# Altium schematic sheet LVDS_eDP.SchDoc
size 420 x 297 mm; SheetNumber: 22; SheetTotal: 32; DocumentTypeShort: Э3; DocumentInvertoryNumber: ㅤ
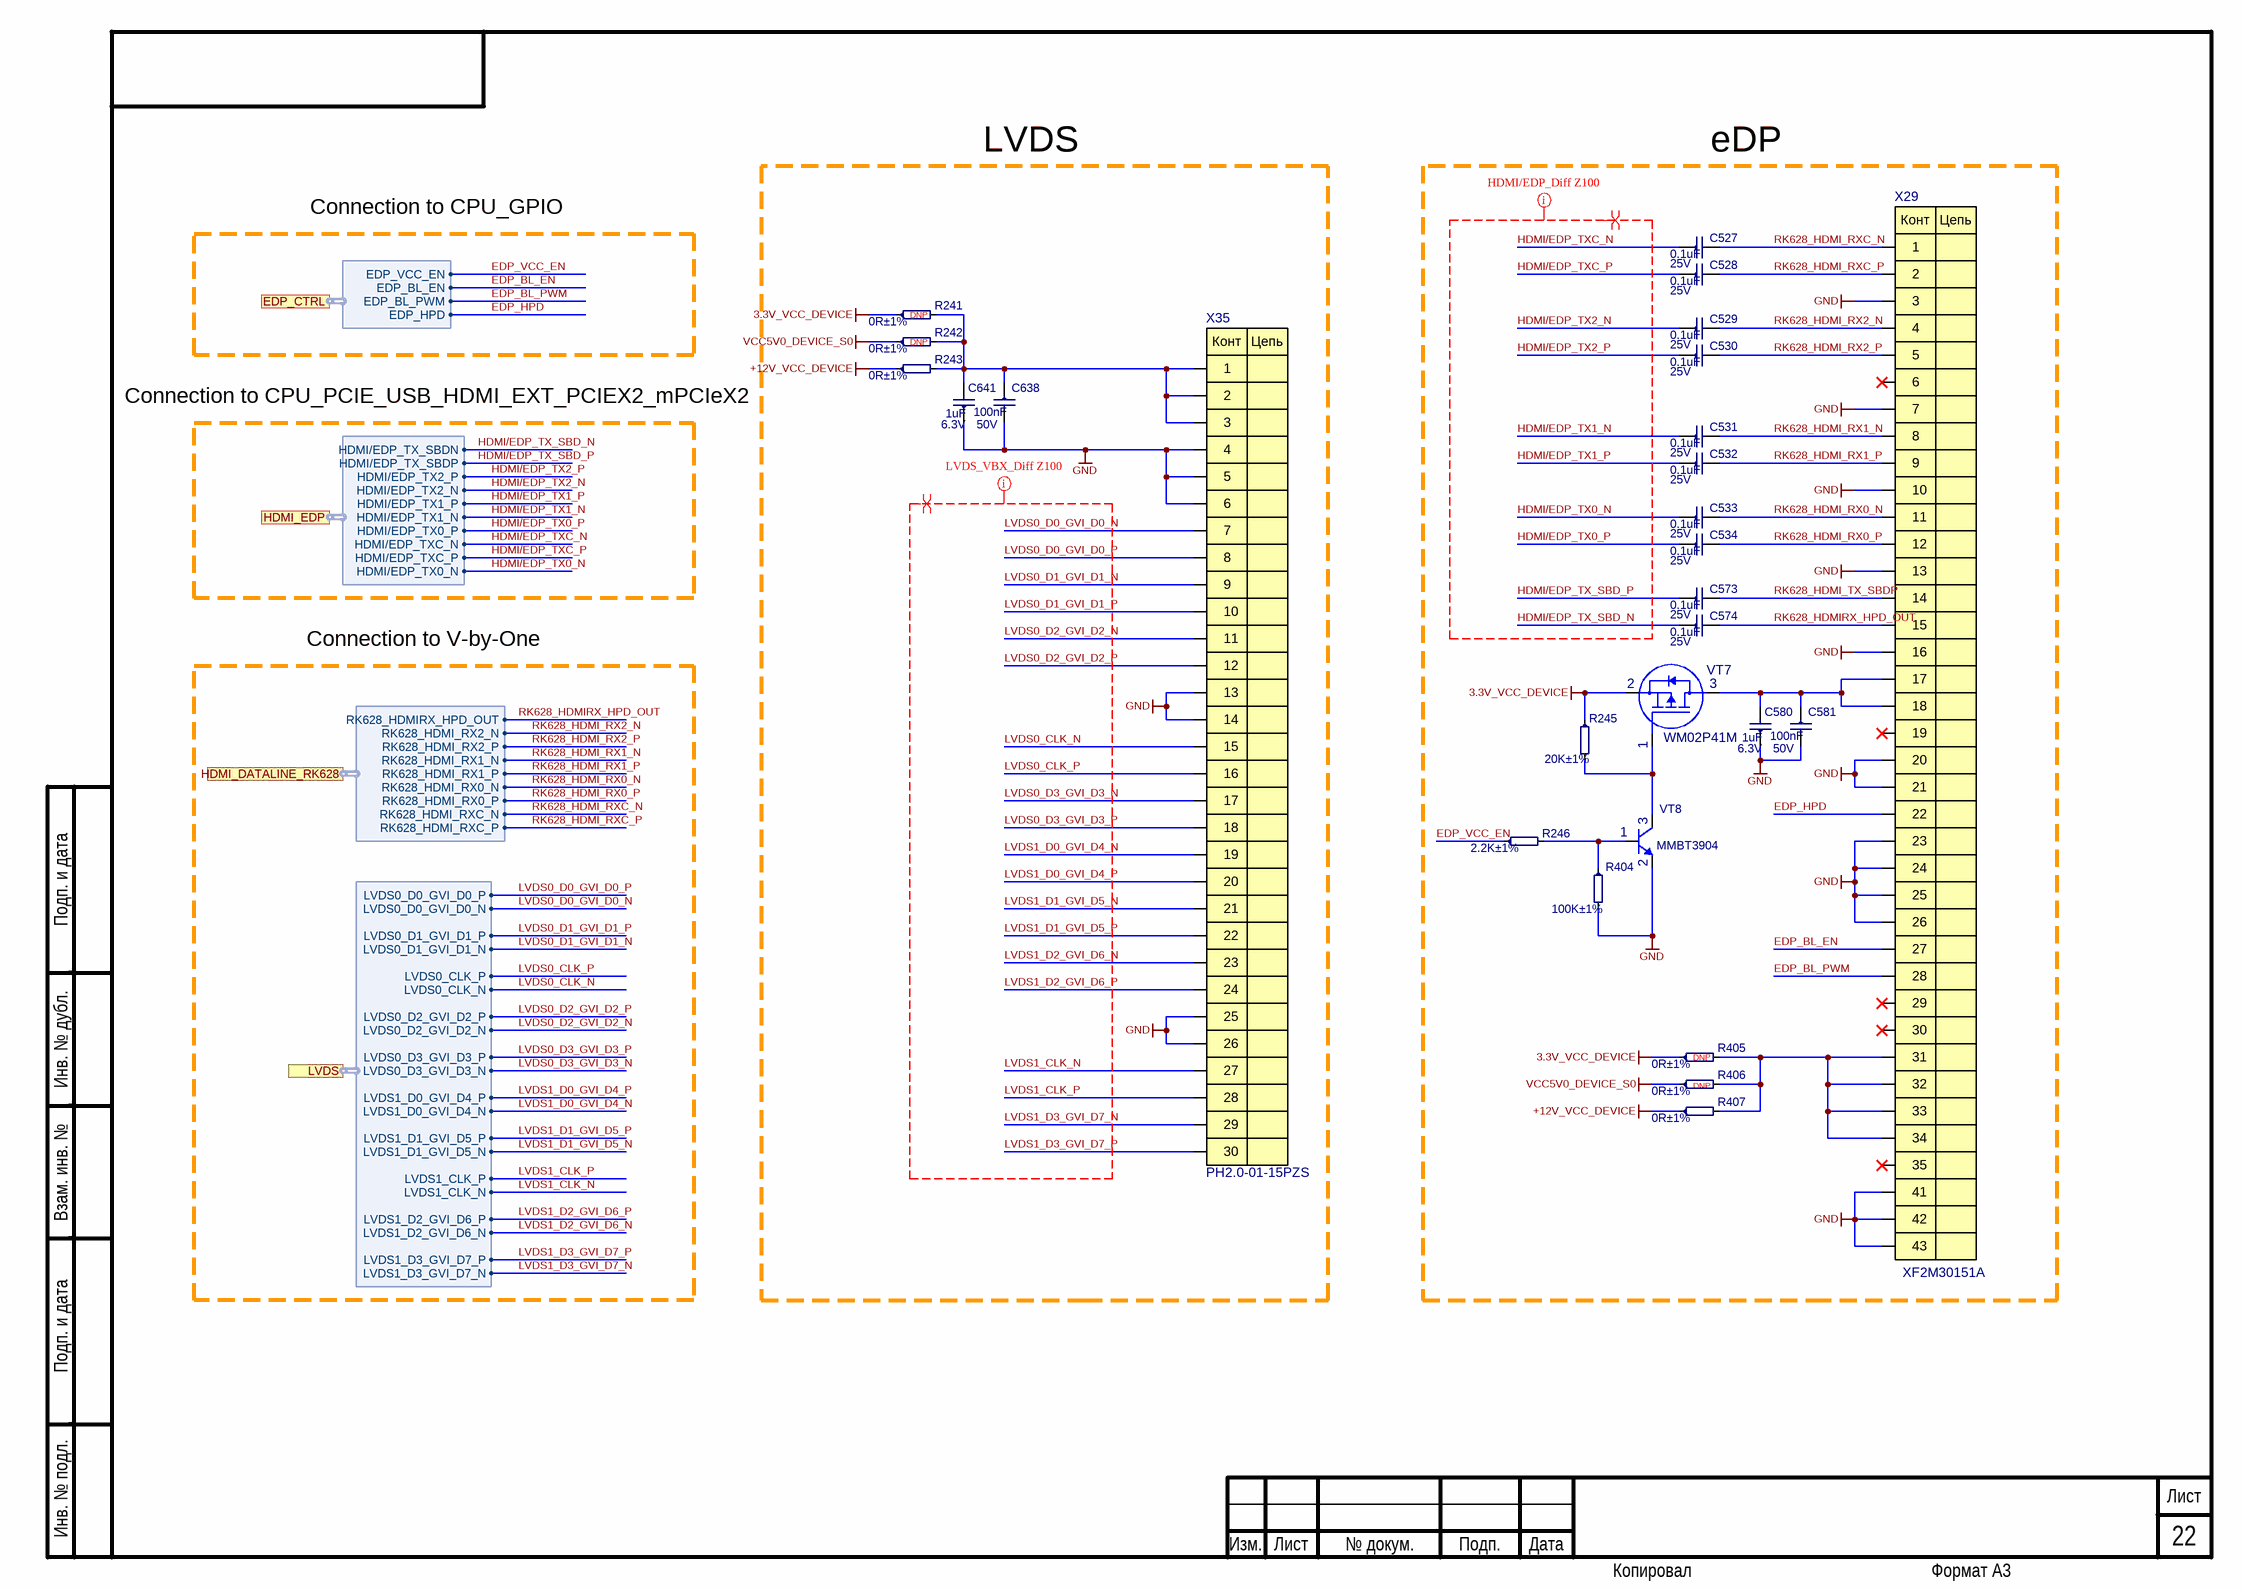
[diagram p0: LVDS_eDP.SchDoc]

## Parts
C527  0.1uF  Voltage: 25V  [C0201]
C528  0.1uF  Voltage: 25V  [C0201]
C529  0.1uF  Voltage: 25V  [C0201]
C530  0.1uF  Voltage: 25V  [C0201]
C531  0.1uF  Voltage: 25V  [C0201]
C532  0.1uF  Voltage: 25V  [C0201]
C533  0.1uF  Voltage: 25V  [C0201]
C534  0.1uF  Voltage: 25V  [C0201]
C573  0.1uF  Voltage: 25V  [C0201]
C574  0.1uF  Voltage: 25V  [C0201]
C580  1uF  Voltage: 6.3V  [C0201]
C581  100nF  Voltage: 50V  [C0402]
C638  100nF  Voltage: 50V  [C0402]
C641  1uF  Voltage: 6.3V  [C0201]
R241  0R±1%  [R0402]
R242  0R±1%  [R0402]
R243  0R±1%  [R0402]
R245  20K±1%  [R0402]
R246  2.2K±1%  [R0402]
R404  100K±1%  [R0402]
R405  0R±1%  [R0402]
R406  0R±1%  [R0402]
R407  0R±1%  [R0402]
VT7  WM02P41M  [SOT23]
VT8  MMBT3904  [SOT23]
X29  XF2M30151A  [XF2M30151A]
X35  PH2.0-01-15PZS  [PH2.0-01-15PZS]

## Ports
EDP_CTRL (harness EDP_CTRL), HDMI_DATALINE_RK628 (harness HDMI_DATALINE_RK628), HDMI_EDP (harness HDMI_EDP), LVDS (harness LVDS)

## Harnesses
LVDS: LVDS0_D0_GVI_D0_N, LVDS0_D1_GVI_D1_P, LVDS0_D1_GVI_D1_N, LVDS0_D0_GVI_D0_P, LVDS0_CLK_P, LVDS0_CLK_N, LVDS0_D2_GVI_D2_P, LVDS0_D2_GVI_D2_N, LVDS0_D3_GVI_D3_P, LVDS0_D3_GVI_D3_N, LVDS1_D0_GVI_D4_P, LVDS1_D0_GVI_D4_N, LVDS1_D1_GVI_D5_P, LVDS1_D1_GVI_D5_N, LVDS1_CLK_P, LVDS1_CLK_N, LVDS1_D2_GVI_D6_P, LVDS1_D2_GVI_D6_N, LVDS1_D3_GVI_D7_P, LVDS1_D3_GVI_D7_N
HDMI_EDP: HDMI/EDP_TX2_N, HDMI/EDP_TX1_P, HDMI/EDP_TX1_N, HDMI/EDP_TX2_P, HDMI/EDP_TX0_P, HDMI/EDP_TXC_N, HDMI/EDP_TXC_P, HDMI/EDP_TX0_N, HDMI/EDP_TX_SBDN, HDMI/EDP_TX_SBDP
HDMI_DATALINE_RK628: RK628_HDMI_RX2_P, RK628_HDMI_RX1_N, RK628_HDMI_RX1_P, RK628_HDMI_RX2_N, RK628_HDMI_RX0_N, RK628_HDMI_RX0_P, RK628_HDMI_RXC_N, RK628_HDMI_RXC_P, RK628_HDMIRX_HPD_OUT
EDP_CTRL: EDP_BL_EN, EDP_BL_PWM, EDP_VCC_EN, EDP_HPD

## Nets
3.3V_VCC_DEVICE: R241.1 R245.1 R405.1 VT7.2
+12V_VCC_DEVICE: R243.1 R407.1
GND: C580.1 C581.2 C638.2 C641.1 R404.2 VT8.2(E) X29.3 X29.7 X29.10 X29.13 X29.16 X29.20 X29.21 X29.23 X29.24 X29.25 X29.26 X29.41 X29.42 X29.43 X35.4 X35.5 X35.6 X35.13 X35.14 X35.25 X35.26
VCC5V0_DEVICE_S0: R242.1 R406.1
EDP_BL_EN: X29.27 ; port EDP_CTRL.EDP_BL_EN
EDP_BL_PWM: X29.28 ; port EDP_CTRL.EDP_BL_PWM
EDP_HPD: X29.22 ; port EDP_CTRL.EDP_HPD
EDP_VCC_EN: R246.1 ; port EDP_CTRL.EDP_VCC_EN
HDMI/EDP_TX0_N: C533.1 ; port HDMI_EDP.HDMI/EDP_TX0_N
HDMI/EDP_TX0_P: C534.1 ; port HDMI_EDP.HDMI/EDP_TX0_P
HDMI/EDP_TX1_N: C531.1 ; port HDMI_EDP.HDMI/EDP_TX1_N
HDMI/EDP_TX1_P: C532.1 ; port HDMI_EDP.HDMI/EDP_TX1_P
HDMI/EDP_TX2_N: C529.1 ; port HDMI_EDP.HDMI/EDP_TX2_N
HDMI/EDP_TX2_P: C530.1 ; port HDMI_EDP.HDMI/EDP_TX2_P
HDMI/EDP_TX_SBD_N: C574.1 ; port HDMI_EDP.HDMI/EDP_TX_SBDN
HDMI/EDP_TX_SBD_P: C573.1 ; port HDMI_EDP.HDMI/EDP_TX_SBDP
HDMI/EDP_TXC_N: C527.1 ; port HDMI_EDP.HDMI/EDP_TXC_N
HDMI/EDP_TXC_P: C528.1 ; port HDMI_EDP.HDMI/EDP_TXC_P
LVDS0_CLK_N: X35.15 ; port LVDS.LVDS0_CLK_N
LVDS0_CLK_P: X35.16 ; port LVDS.LVDS0_CLK_P
LVDS0_D0_GVI_D0_N: X35.7 ; port LVDS.LVDS0_D0_GVI_D0_N
LVDS0_D0_GVI_D0_P: X35.8 ; port LVDS.LVDS0_D0_GVI_D0_P
LVDS0_D1_GVI_D1_N: X35.9 ; port LVDS.LVDS0_D1_GVI_D1_N
LVDS0_D1_GVI_D1_P: X35.10 ; port LVDS.LVDS0_D1_GVI_D1_P
LVDS0_D2_GVI_D2_N: X35.11 ; port LVDS.LVDS0_D2_GVI_D2_N
LVDS0_D2_GVI_D2_P: X35.12 ; port LVDS.LVDS0_D2_GVI_D2_P
LVDS0_D3_GVI_D3_N: X35.17 ; port LVDS.LVDS0_D3_GVI_D3_N
LVDS0_D3_GVI_D3_P: X35.18 ; port LVDS.LVDS0_D3_GVI_D3_P
LVDS1_CLK_N: X35.27 ; port LVDS.LVDS1_CLK_N
LVDS1_CLK_P: X35.28 ; port LVDS.LVDS1_CLK_P
LVDS1_D0_GVI_D4_N: X35.19 ; port LVDS.LVDS1_D0_GVI_D4_N
LVDS1_D0_GVI_D4_P: X35.20 ; port LVDS.LVDS1_D0_GVI_D4_P
LVDS1_D1_GVI_D5_N: X35.21 ; port LVDS.LVDS1_D1_GVI_D5_N
LVDS1_D1_GVI_D5_P: X35.22 ; port LVDS.LVDS1_D1_GVI_D5_P
LVDS1_D2_GVI_D6_N: X35.23 ; port LVDS.LVDS1_D2_GVI_D6_N
LVDS1_D2_GVI_D6_P: X35.24 ; port LVDS.LVDS1_D2_GVI_D6_P
LVDS1_D3_GVI_D7_N: X35.29 ; port LVDS.LVDS1_D3_GVI_D7_N
LVDS1_D3_GVI_D7_P: X35.30 ; port LVDS.LVDS1_D3_GVI_D7_P
RK628_HDMI_RX0_N: C533.2 X29.11 ; port HDMI_DATALINE_RK628.RK628_HDMI_RX0_N
RK628_HDMI_RX0_P: C534.2 X29.12 ; port HDMI_DATALINE_RK628.RK628_HDMI_RX0_P
RK628_HDMI_RX1_N: C531.2 X29.8 ; port HDMI_DATALINE_RK628.RK628_HDMI_RX1_N
RK628_HDMI_RX1_P: C532.2 X29.9 ; port HDMI_DATALINE_RK628.RK628_HDMI_RX1_P
RK628_HDMI_RX2_N: C529.2 X29.4 ; port HDMI_DATALINE_RK628.RK628_HDMI_RX2_N
RK628_HDMI_RX2_P: C530.2 X29.5 ; port HDMI_DATALINE_RK628.RK628_HDMI_RX2_P
RK628_HDMI_RXC_N: C527.2 X29.1 ; port HDMI_DATALINE_RK628.RK628_HDMI_RXC_N
RK628_HDMI_RXC_P: C528.2 X29.2 ; port HDMI_DATALINE_RK628.RK628_HDMI_RXC_P
RK628_HDMI_TX_SBDP: C573.2 X29.14
RK628_HDMIRX_HPD_OUT: C574.2 X29.15 ; port HDMI_DATALINE_RK628.RK628_HDMIRX_HPD_OUT
NetC580_2: C580.2 C581.1 VT7.3 X29.17 X29.18
NetC638_1: C638.1 C641.2 R241.2 R242.2 R243.2 X35.1 X35.2 X35.3
NetR245_2: R245.2 VT7.1 VT8.3(C)
NetR246_2: R246.2 R404.1 VT8.1(B)
NetR405_2: R405.2 R406.2 R407.2 X29.31 X29.32 X29.33 X29.34

Not connected (* = marked no-connect by the designer): X29 6* 19* 29* 30* 35*

## Layout directives
net class LVDS_VBX: LVDS0_CLK_N, LVDS0_CLK_P, LVDS0_D0_GVI_D0_N, LVDS0_D0_GVI_D0_P, LVDS0_D1_GVI_D1_N, LVDS0_D1_GVI_D1_P, LVDS0_D2_GVI_D2_N, LVDS0_D2_GVI_D2_P, LVDS0_D3_GVI_D3_N, LVDS0_D3_GVI_D3_P, LVDS1_CLK_N, LVDS1_CLK_P, LVDS1_D0_GVI_D4_N, LVDS1_D0_GVI_D4_P, LVDS1_D1_GVI_D5_N, LVDS1_D1_GVI_D5_P, LVDS1_D2_GVI_D6_N, LVDS1_D2_GVI_D6_P, LVDS1_D3_GVI_D7_N, LVDS1_D3_GVI_D7_P
differential pair; differential pair class Diff_Z100: HDMI/EDP_TX0_N, HDMI/EDP_TX0_P, HDMI/EDP_TX1_N, HDMI/EDP_TX1_P, HDMI/EDP_TX2_N, HDMI/EDP_TX2_P, HDMI/EDP_TX_SBD_N, HDMI/EDP_TX_SBD_P, HDMI/EDP_TXC_N, HDMI/EDP_TXC_P, LVDS0_CLK_N, LVDS0_CLK_P, LVDS0_D0_GVI_D0_N, LVDS0_D0_GVI_D0_P, LVDS0_D1_GVI_D1_N, LVDS0_D1_GVI_D1_P, LVDS0_D2_GVI_D2_N, LVDS0_D2_GVI_D2_P, LVDS0_D3_GVI_D3_N, LVDS0_D3_GVI_D3_P, LVDS1_CLK_N, LVDS1_CLK_P, LVDS1_D0_GVI_D4_N, LVDS1_D0_GVI_D4_P, LVDS1_D1_GVI_D5_N, LVDS1_D1_GVI_D5_P, LVDS1_D2_GVI_D6_N, LVDS1_D2_GVI_D6_P, LVDS1_D3_GVI_D7_N, LVDS1_D3_GVI_D7_P
net class HDMI/EDP: HDMI/EDP_TX0_N, HDMI/EDP_TX0_P, HDMI/EDP_TX1_N, HDMI/EDP_TX1_P, HDMI/EDP_TX2_N, HDMI/EDP_TX2_P, HDMI/EDP_TX_SBD_N, HDMI/EDP_TX_SBD_P, HDMI/EDP_TXC_N, HDMI/EDP_TXC_P

## Notes on the sheet
- LVDS
- eDP
- Connection to CPU_GPIO
- (near R241) DNP
- Connection to CPU_PCIE_USB_HDMI_EXT_PCIEX2_mPCIeX2
- (near R242) DNP
- Connection to V-by-One
- (near R405) DNP
- (near R406) DNP
- Подп. и дата
- Инв. № дубл.
- Взам. инв. №
- Инв. № подл.
- Изм.
- Лист
- № докум.
- Подп.
- Дата
- Копировал
- Формат А3
- (in symbol PH2.0-01-15PZS) Конт; Цепь
- (in symbol XF2M30151A) Конт; Цепь

## Library data of the parts
C527-C534 C573 C574 = 0201-X5R-25V-0.1uF±10%: Manufacturer: Yageo; NameFromManufacturer: CC0201KRX5R8BB104; Dielectric: X5R; Place: *); Tolerance: 10%; Check: False; Case: C0201; Part Number: 0201-X5R-25V-0.1uF±10%; Value: 0.1uF; Temperature: -55°C~85°C; ComponentLink2Description: Link to datasheet; ComponentLink1Description: DATASHEET; ComponentLink2URL: https://octopart.com/cc0201krx5r8bb104-yageo-88496683?r=sp; ComponentLink1URL: Datasheets/capacitors/UPY-GPHC_X5R_4V-to-50V_26.pdf; Last changed: 27.10.2022
C580 C641 = 0201-X5R-6.3V-1uF±20%: Manufacturer: Murata Electronics; NameFromManufacturer: GRM033R60J105MEA2D; Dielectric: X5R; Place: *); Tolerance: 20%; Check: False; Case: C0201; Part Number: 0201-X5R-6.3V-1uF±20%; Value: 1uF; Temperature: -55°C~85°C; ComponentLink2Description: Link to datasheet; ComponentLink1Description: DATASHEET; ComponentLink2URL: https://www.terraelectronica.ru/product/1209278; ComponentLink1URL: Datasheets/capacitors/GRM033R60J105MEA2-61A.pdf; Last changed: 27.10.2022
C581 C638 = 0402-X7R-50V-0.1uF±10%: Ceramic Capacitor 0402 100nF ±10% 50V X7R; Manufacturer: Yageo; NameFromManufacturer: CC0402KRX7R9BB104; Place: *); Check: False; Dielectric: X7R; Case: C0402; Part Number: 0402-X7R-50V-0.1uF±10%; Value: 100nF; Tolerance: 10%; Temperature: -55°C~125°C; ComponentLink2Description: Link to datasheet; ComponentLink1Description: DATASHEET; ComponentLink2URL: https://www.lcsc.com/product-detail/Multilayer-Ceramic-Capacitors-MLCC-SMD-SMT_YAGEO-CC0402KRX7R9BB104_C131394.html; Last changed: 09.04.2025
R241-R243 R405-R407 = 0402-0.0625W-0R-100ppm±1%: Chip Resistor 0402 0Ω ±1% 50V ±100ppm/℃ Thick Film; NameFromManufacturer: RC0402FR-070RL; Manufacturer: Yageo; Place: *); Value: 0R; Check: False; Case: R0402; Part Number: 0402-0.0625W-0R-100ppm±1%; Tolerance: 1%; Temperature: -55°C~155°C; ComponentLink1Description: DATASHEET; ComponentLink1URL: https://www.chipdip.ru/product0/8000617426?ysclid=l7og5x0plo427794326; Datasheet: Datasheets/resistors/DOC012445956.pdf; Last changed: 27.10.2022
R245 = 0402-0.0625W-20K-100ppm±1%: Chip Resistor 0402 20kΩ ±1% 50V ±100ppm/℃ Thick Film; NameFromManufacturer: RC0402FR-0720KL; Manufacturer: Yageo; Place: *); Value: 20K; Check: False; Case: R0402; Part Number: 0402-0.0625W-20K-100ppm±1%; Tolerance: 1%; Temperature: -55°C~155°C; ComponentLink1Description: DATASHEET; ComponentLink1URL: https://www.terraelectronica.ru/product/506449; Datasheet: Datasheets/resistors/PYu-RC_Group_51_RoHS_L_11.pdf; Last changed: 27.10.2022
R246 = 0402-0.0625W-2.2K-100ppm±1%: *; NameFromManufacturer: RC0402FR-072K2L; Manufacturer: Yageo; Place: *); Value: 2.2K; Tolerance: 1%; Check: False; Case: R0402; Part Number: 0402-0.0625W-2.2K-100ppm±1%; Temperature: -55°C~155°C; ComponentLink1Description: DATASHEET; ComponentLink1URL: https://www.compel.ru/infosheet/YAG/SR0402FR-072K2L; Datasheet: Datasheets/resistors/PYu-SR_D_F tol_RoHS_L_5.pdf; Last changed: 27.10.2022
R404 = 0402-0.0625W-100K-100ppm±1%: Chip Resistor 0402 100kΩ ±1% 50V ±100ppm/℃ Thick Film; NameFromManufacturer: RC0402FR-07100KL; Manufacturer: Yageo; Place: *); Value: 100K; Check: False; Case: R0402; Part Number: 0402-0.0625W-100K-100ppm±1%; Tolerance: 1%; Temperature: -55°C~155°C; ComponentLink1Description: DATASHEET; ComponentLink1URL: https://www.yageo.com/upload/media/product/productsearch/datasheet/rchip/PYu-RC_Group_51_RoHS_L_11.pdf; Datasheet: Datasheets/resistors/PYu-RC_Group_51_RoHS_L_11.pdf; Last changed: 27.10.2022
VT7 = WM02P41M: Small signal mosfet; Manufacturer: Wayon; Place: S; Voltage: -20V; Check: False; Part Number: WM02P41M; Value: WM02P41M; Temperature: -55°C~150°C; ComponentLink1Description: DATASHEET; NameFromManufacturer: WM02P41M; ComponentLink1URL: https://www.terraelectronica.ru/product/5031341; Datasheet: Datasheets/transistors/UM6K34NTCN.pdf; Last changeв: 27.10.2022
VT8 = MMBT3904: NPN transistor; Manufacturer: Diotec Semiconductor; Place: S; Voltage: 40V; Check: False; Part Number: MMBT3904; Value: MMBT3904; Temperature: -55°C~150°C; ComponentLink1Description: DATASHEET; NameFromManufacturer: MMBT3904; ComponentLink1URL: https://www.terraelectronica.ru/product/607582; Datasheet: Datasheets/transistors/mmbt3904.pdf; Last changeв: 27.10.2022
X29 = XF2M30151A: FFC разъем, 30PIN, 0.5мм, 50В; Manufacturer: Omron; Check: False; Part Number: XF2M30151A; Value: XF2M30151A; NameFromManufacturer: XF2M30151A
X35 = PH2.0-01-15PZS: Pin Header 30 Position 2mm Pitch Dual Row Through Hole -40℃~+105℃; Manufacturer: XUNPU; Check: False; Part Number: PH2.0-01-15PZS; Value: PH2.0-01-15PZS; NameFromManufacturer: PH2.0-01-15PZS